# Altium project usb.PrjPcb
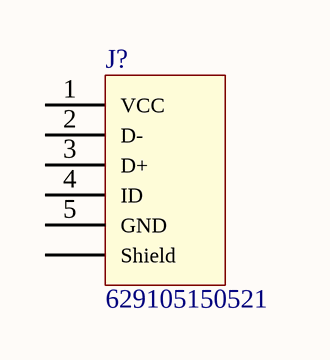
[diagram p0: usb.SchDoc]
1 sheet, 1 parts. Net scope: global (net labels, ports and power ports of the same name join across sheets).
Board file: usb.PcbDoc

## Sheet usb.SchDoc
size A4

### Parts
J?  629105150521  [629105150521]

### Nets

Not connected (* = marked no-connect by the designer): J? 1(VCC) 2(D-) 3(D+) 4(ID) 5(GND) Shell(Shield)

### Library data of the parts
J? = 629105150521: Micro USB 2.0 SMT Type B Horizontal 5 Contacts High Current WR-COM; Interface Type: Type B; Gender: Receptacle; ComponentLink1Description: Manufacturer; ComponentLink1URL: http://www.we-online.de; ComponentLink2Description: Datasheet; ComponentLink2URL: http://katalog.we-online.de/em/datasheet/629105150521.pdf; Part Number: 629105150521; Published Date: April 2017; Publisher: Wurth Elektronik; Sub-Family: Micro USB 2.0; Type: Horizontal; Construction: SMT